# EAGLE schematic M_C_ext_esp32 (EAGLE 9.6.2)
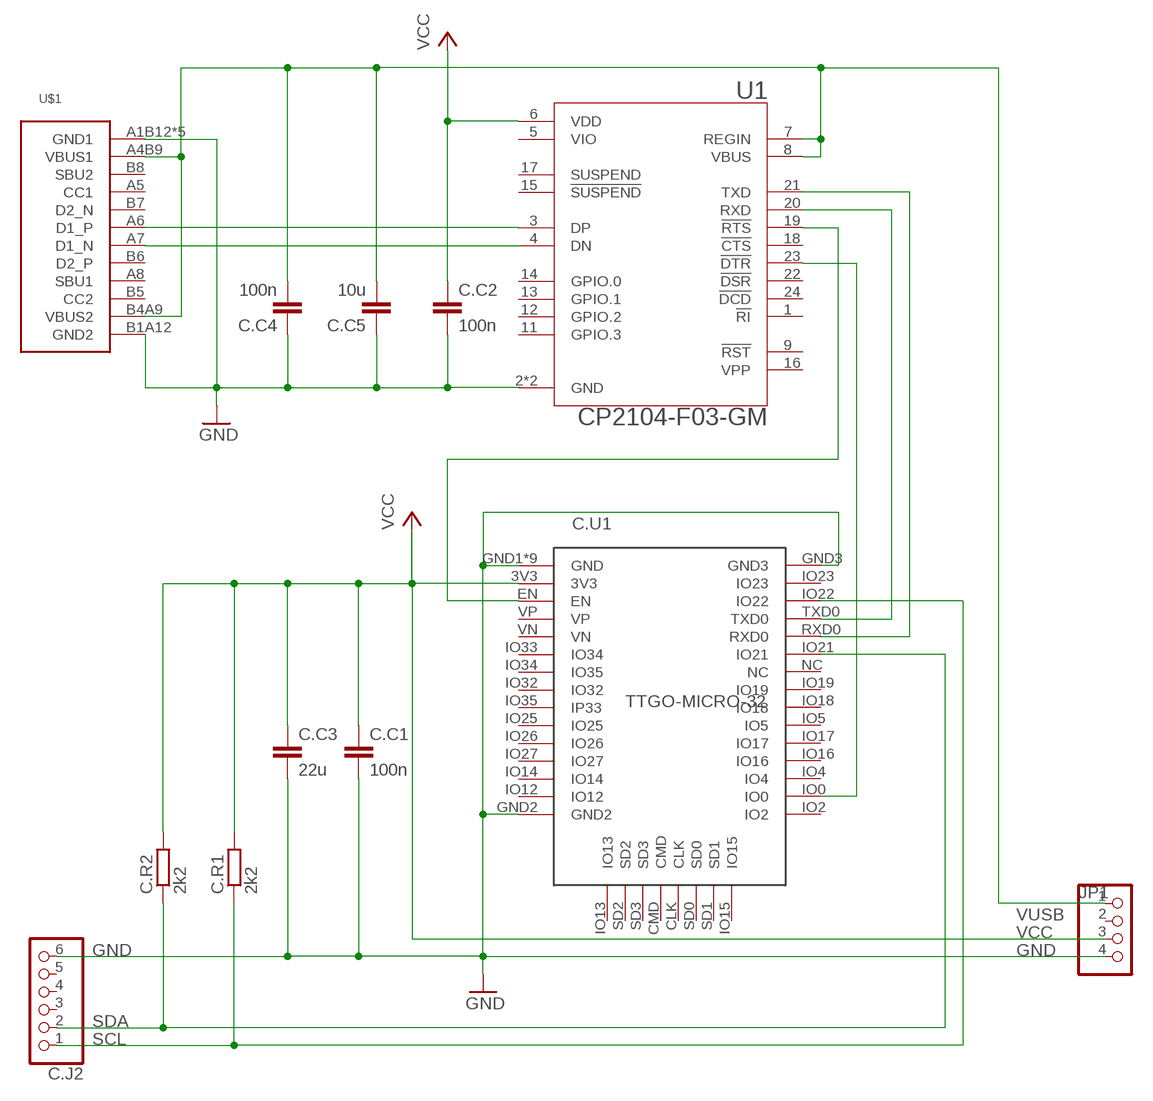
[diagram p0: schematic, sheet 1]

## Parts
C.C1  100n  C-EUC0603  [C0603]
C.C2  100n  C-EUC0603  [C0603]
C.C3  22u  C-EUC0805  [C0805]
C.C4  100n  C-EUC0603  [C0603]
C.C5  10u  C-EUC0603  [C0603]
C.J2  PINHD-1X6  [1X06]
C.R1  2k2  R-EU_R0603  [R0603]
C.R2  2k2  R-EU_R0603  [R0603]
C.U1  TTGO-MICRO-32  [TTGO-MICRO-32]
JP1  PINHD-1X4  [1X04]
U1  CP2104-F03-GM  [QFN50P400X400X80-25N]
U$1  USB-C  [USB-C]

## Nets
GND: C.C1.2 C.C2.2 C.C3.2 C.C4.1 C.C5.1 C.J2.6 C.U1.GND1(GND) C.U1.GND2 C.U1.GND3 C.U1.GND4(GND) C.U1.GND5(GND) C.U1.GND6(GND) C.U1.GND7(GND) C.U1.GND8(GND) C.U1.GND9(GND) C.U1.GND10(GND) C.U1.GND11(GND) JP1.4 U1.2(GND) U1.25(GND) U$1.A1B12(GND1) U$1.B1A12(GND2) U$1.SH1(GND1) U$1.SH2(GND1) U$1.SH3(GND1) U$1.SH4(GND1)
N$1: U1.4(DN) U$1.A7(D1_N)
N$2: U1.3(DP) U$1.A6(D1_P)
PROG: C.U1.IO0 U1.23(!DTR)
RESET: C.U1.EN U1.19(!RTS)
RX: C.U1.TXD0 U1.20(RXD)
SCL: C.J2.1 C.R1.1 C.U1.IO22
SDA: C.J2.2 C.R2.1 C.U1.IO21
TX: C.U1.RXD0 U1.21(TXD)
VCC: C.C1.1 C.C2.1 C.C3.1 C.R1.2 C.R2.2 C.U1.3V3 JP1.3 U1.6(VDD)
VUSB: C.C4.2 C.C5.2 JP1.1 U1.7(REGIN) U1.8(VBUS) U$1.A4B9(VBUS1) U$1.B4A9(VBUS2)
Unconnected: C.J2.3 C.J2.4 C.J2.5 C.U1.CLK C.U1.CMD C.U1.IO2 C.U1.IO4 C.U1.IO5 C.U1.IO12 C.U1.IO13 C.U1.IO14 C.U1.IO15 C.U1.IO16 C.U1.IO17 C.U1.IO18 C.U1.IO19 C.U1.IO23 C.U1.IO25 C.U1.IO26 C.U1.IO27 C.U1.IO32 C.U1.IO33(IO34) C.U1.IO34(IO35) C.U1.IO35(IP33) C.U1.NC C.U1.SD0 C.U1.SD1 C.U1.SD2 C.U1.SD3 C.U1.VN C.U1.VP JP1.2 U1.1(!RI) U1.9(!RST!) U1.11(GPIO.3) U1.12(GPIO.2) U1.13(GPIO.1) U1.14(GPIO.0) U1.15(!SUSPEND!) U1.16(VPP) U1.17(SUSPEND) U1.18(!CTS) U1.22(!DSR) U1.24(!DCD) U$1.A5(CC1) U$1.A8(SBU1) U$1.B5(CC2) U$1.B6(D2_P) U$1.B7(D2_N) U$1.B8(SBU2)

## Power pins joined to a net without a drawn wire
VIO: U1.5(VIO)

## Library data of the parts
C.C1-C.C5 = rcl:C-EU: CAPACITOR, European symbol; SPICEPREFIX: C
C.J2 = pinhead2:PINHD-1X6: PIN HEADER
C.R1 C.R2 = rcl:R-EU_: RESISTOR, European symbol; SPICEPREFIX: R
C.U1 = hugo:TTGO-MICRO-32
JP1 = pinhead2:PINHD-1X4: PIN HEADER
U1 = CP2104:CP2104: Silabs CP2104 USB to UART Bridge; AVAILABILITY: Unavailable; DESCRIPTION: USB Bridge, USB to UART USB 2.0 UART Interface 24-QFN (4x4); MF: Silicon Labs; MP: CP2104; PACKAGE: QFN-24 Silicon Labs; PRICE: None
U$1 = hugo:USB-C